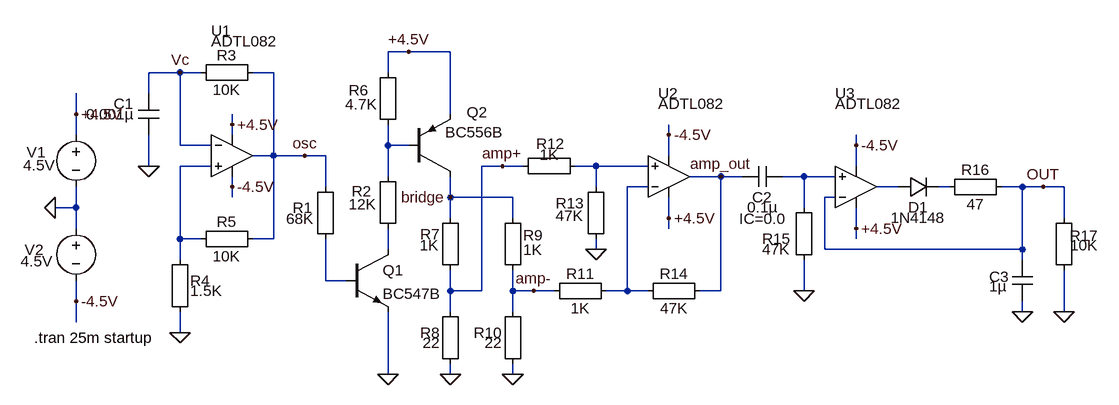
[diagram p0: schematic esr_meter.asc]
esr_meter.asc, the LTspice schematic file:
Version 4
SHEET 1 1856 680
WIRE 512 -16 480 -16
WIRE 576 -16 512 -16
WIRE 160 16 112 16
WIRE 192 16 160 16
WIRE 304 16 272 16
WIRE 480 16 480 -16
WIRE 112 48 112 16
WIRE 0 80 0 48
WIRE 576 80 576 -16
WIRE 240 96 240 80
WIRE 0 112 0 80
WIRE 240 112 240 96
WIRE 912 112 912 96
WIRE 160 128 160 16
WIRE 208 128 160 128
WIRE 480 128 480 96
WIRE 512 128 480 128
WIRE 1200 128 1200 112
WIRE 304 144 304 16
WIRE 304 144 272 144
WIRE 352 144 304 144
WIRE 384 144 352 144
WIRE 912 144 912 112
WIRE 112 160 112 112
WIRE 208 160 160 160
WIRE 656 160 624 160
WIRE 688 160 656 160
WIRE 800 160 768 160
WIRE 880 160 800 160
WIRE 1200 160 1200 128
WIRE 480 176 480 128
WIRE 992 176 944 176
WIRE 1024 176 992 176
WIRE 1120 176 1088 176
WIRE 1168 176 1120 176
WIRE 240 192 240 176
WIRE 384 192 384 144
WIRE 800 192 800 160
WIRE 880 192 848 192
WIRE 1264 192 1232 192
WIRE 1344 192 1328 192
WIRE 1456 192 1424 192
WIRE 1488 192 1456 192
WIRE 1520 192 1488 192
WIRE 240 208 240 192
WIRE 576 208 576 176
WIRE 672 208 576 208
WIRE 1168 208 1152 208
WIRE 0 224 0 192
WIRE 0 224 -32 224
WIRE 1120 224 1120 176
WIRE 576 240 576 208
WIRE 672 240 672 208
WIRE 912 240 912 208
WIRE 1520 240 1520 192
WIRE 0 256 0 224
WIRE 912 256 912 240
WIRE 1200 256 1200 224
WIRE 160 272 160 160
WIRE 192 272 160 272
WIRE 304 272 304 144
WIRE 304 272 272 272
WIRE 1200 272 1200 256
WIRE 480 288 480 256
WIRE 800 288 800 272
WIRE 1152 288 1152 208
WIRE 1456 288 1456 192
WIRE 1456 288 1152 288
WIRE 160 304 160 272
WIRE 1456 304 1456 288
WIRE 384 336 384 272
WIRE 416 336 384 336
WIRE 576 352 576 320
WIRE 624 352 624 160
WIRE 624 352 576 352
WIRE 672 352 672 320
WIRE 704 352 672 352
WIRE 736 352 704 352
WIRE 848 352 848 192
WIRE 848 352 816 352
WIRE 880 352 848 352
WIRE 992 352 992 176
WIRE 992 352 960 352
WIRE 1120 352 1120 304
WIRE 0 368 0 336
WIRE 576 384 576 352
WIRE 672 384 672 352
WIRE 1456 384 1456 368
WIRE 1520 384 1520 320
WIRE 0 400 0 368
WIRE 160 416 160 384
WIRE 480 480 480 384
WIRE 576 480 576 464
WIRE 672 480 672 464
FLAG 0 80 +4.5V
FLAG 0 368 -4.5V
FLAG 240 96 +4.5V
FLAG 240 192 -4.5V
FLAG 112 160 0
FLAG 352 144 osc
FLAG -32 224 0
FLAG 160 16 Vc
FLAG 480 480 0
FLAG 576 480 0
FLAG 672 480 0
FLAG 512 -16 +4.5V
FLAG 576 208 bridge
FLAG 912 240 +4.5V
FLAG 912 112 -4.5V
FLAG 800 288 0
FLAG 1120 352 0
FLAG 1200 256 +4.5V
FLAG 1200 128 -4.5V
FLAG 1456 384 0
FLAG 1520 384 0
FLAG 1488 192 OUT
FLAG 992 176 amp_out
FLAG 656 160 amp+
FLAG 704 352 amp-
FLAG 160 416 0
SYMBOL voltage 0 96 R0
WINDOW 0 -76 43 Left 2
WINDOW 3 -81 63 Left 2
WINDOW 123 0 0 Left 2
WINDOW 39 -81 91 Left 2
SYMATTR InstName V1
SYMATTR Value 4.5V
SYMBOL Misc\\EuropeanResistor 288 0 R90
WINDOW 0 5 56 VBottom 2
WINDOW 3 27 56 VTop 2
SYMATTR InstName R3
SYMATTR Value 10K
SYMATTR SpiceLine tol=1 pwr=0.1
SYMBOL Misc\\EuropeanResistor 176 400 R180
WINDOW 0 0 64 Right 2
WINDOW 3 0 48 Right 2
SYMATTR InstName R4
SYMATTR Value 1.5K
SYMATTR SpiceLine tol=1 pwr=0.1
SYMBOL Misc\\EuropeanResistor 288 256 R90
WINDOW 0 5 56 VBottom 2
WINDOW 3 27 56 VTop 2
SYMATTR InstName R5
SYMATTR Value 10K
SYMATTR SpiceLine tol=1 pwr=0.1
SYMBOL cap 96 48 R0
WINDOW 0 -7 16 Right 2
WINDOW 3 -6 32 Right 2
SYMATTR InstName C1
SYMATTR Value 0.001µ
SYMATTR SpiceLine V=16 Irms=55.6m Rser=5.11126 Lser=0 mfg="KEMET" pn="C0603C102K4RAC" type="X7R"
SYMBOL voltage 0 240 R0
WINDOW 0 -79 49 Left 2
WINDOW 3 -85 66 Left 2
WINDOW 123 0 0 Left 2
WINDOW 39 -85 94 Left 2
SYMATTR InstName V2
SYMATTR Value 4.5V
SYMBOL Misc\\EuropeanResistor 368 176 R0
WINDOW 0 -35 48 Left 2
WINDOW 3 -45 65 Left 2
SYMATTR InstName R1
SYMATTR Value 68K
SYMATTR SpiceLine tol=1 pwr=0.1
SYMBOL Misc\\EuropeanResistor 496 272 R180
WINDOW 0 41 73 Left 2
WINDOW 3 34 53 Left 2
SYMATTR InstName R2
SYMATTR Value 12K
SYMATTR SpiceLine tol=1 pwr=0.1
SYMBOL Misc\\EuropeanResistor 496 112 R180
WINDOW 0 46 69 Left 2
WINDOW 3 32 47 Left 2
SYMATTR InstName R6
SYMATTR Value 4.7K
SYMATTR SpiceLine tol=1 pwr=0.1
SYMBOL Misc\\EuropeanResistor 592 336 R180
WINDOW 0 32 71 Left 2
WINDOW 3 34 54 Left 2
SYMATTR InstName R7
SYMATTR Value 1K
SYMATTR SpiceLine tol=1 pwr=0.1
SYMBOL Misc\\EuropeanResistor 592 480 R180
WINDOW 0 32 64 Left 2
WINDOW 3 32 48 Left 2
SYMATTR InstName R8
SYMATTR Value 22
SYMATTR SpiceLine tol=1 pwr=0.1
SYMBOL Misc\\EuropeanResistor 688 336 R180
WINDOW 0 -31 70 Left 2
WINDOW 3 -29 47 Left 2
SYMATTR InstName R9
SYMATTR Value 1K
SYMATTR SpiceLine tol=1 pwr=0.1
SYMBOL Misc\\EuropeanResistor 688 480 R180
WINDOW 0 32 64 Left 2
WINDOW 3 32 48 Left 2
SYMATTR InstName R10
SYMATTR Value 22
SYMATTR SpiceLine tol=1 pwr=0.1
SYMBOL npn 416 288 R0
SYMATTR InstName Q1
SYMATTR Value BC547B
SYMBOL pnp 512 176 M180
WINDOW 0 89 99 Left 2
SYMATTR InstName Q2
SYMATTR Value BC556B
SYMBOL Misc\\EuropeanResistor 720 368 R270
WINDOW 0 27 56 VTop 2
WINDOW 3 5 56 VBottom 2
SYMATTR InstName R11
SYMATTR Value 1K
SYMATTR SpiceLine tol=1 pwr=0.1
SYMBOL Misc\\EuropeanResistor 672 176 R270
WINDOW 0 66 58 VBottom 2
WINDOW 3 49 56 VBottom 2
SYMATTR InstName R12
SYMATTR Value 1K
SYMATTR SpiceLine tol=1 pwr=0.1
SYMBOL Misc\\EuropeanResistor 784 176 R0
WINDOW 0 -46 41 Left 2
WINDOW 3 -46 60 Left 2
SYMATTR InstName R13
SYMATTR Value 47K
SYMATTR SpiceLine tol=1 pwr=0.1
SYMBOL Misc\\EuropeanResistor 976 336 R90
WINDOW 0 5 56 VBottom 2
WINDOW 3 27 56 VTop 2
SYMATTR InstName R14
SYMATTR Value 47K
SYMATTR SpiceLine tol=1 pwr=0.1
SYMBOL cap 1088 160 R90
WINDOW 0 32 32 VTop 2
WINDOW 3 48 32 VTop 2
WINDOW 40 65 32 VTop 2
SYMATTR InstName C2
SYMATTR Value 0.1µ
SYMATTR SpiceLine V=10 Irms=728m Rser=0.14361 Lser=0 mfg="KEMET" pn="C0603C104K8RAC" type="X7R"
SYMATTR SpiceLine2 IC=0.0
SYMBOL Misc\\EuropeanResistor 1104 208 R0
WINDOW 0 -48 64 Left 2
WINDOW 3 -48 80 Left 2
SYMATTR InstName R15
SYMATTR Value 47K
SYMATTR SpiceLine tol=1 pwr=0.1
SYMBOL Misc\\EuropeanResistor 1328 208 R270
WINDOW 0 27 56 VTop 2
WINDOW 3 5 56 VBottom 2
SYMATTR InstName R16
SYMATTR Value 47
SYMATTR SpiceLine tol=1 pwr=0.1
SYMBOL cap 1440 304 R0
WINDOW 0 -35 26 Left 2
WINDOW 3 -35 41 Left 2
SYMATTR InstName C3
SYMATTR Value 1µ
SYMATTR SpiceLine V=10 Irms=2.59 Rser=0.0171188 Lser=0 mfg="KEMET" pn="C0603C105K8RAC" type="X7R"
SYMBOL diode 1264 208 R270
WINDOW 0 0 32 VBottom 2
WINDOW 3 -16 32 VBottom 2
SYMATTR InstName D1
SYMATTR Value 1N4148
SYMBOL Misc\\EuropeanResistor 1536 336 R180
WINDOW 0 -37 69 Left 2
WINDOW 3 -36 54 Left 2
SYMATTR InstName R17
SYMATTR Value 10K
SYMATTR SpiceLine tol=1 pwr=0.1
SYMBOL Opamps\\ADTL082 240 80 R0
WINDOW 0 -32 -128 Left 2
WINDOW 3 -32 -112 Left 2
SYMATTR InstName U1
SYMBOL Opamps\\ADTL082 912 240 M180
WINDOW 0 -16 192 Left 2
WINDOW 3 -16 176 Left 2
SYMATTR InstName U2
SYMBOL Opamps\\ADTL082 1200 256 M180
WINDOW 0 -32 208 Left 2
WINDOW 3 -32 192 Left 2
SYMATTR InstName U3
TEXT -64 424 Left 2 !.tran 25m startup

The netlist it stands for:
* esr_meter.asc
V1 +4.5V 0 4.5V
R3 osc Vc 10K tol=1 pwr=0.1
R4 0 N002 1.5K tol=1 pwr=0.1
R5 osc N002 10K tol=1 pwr=0.1
C1 Vc 0 0.001µ V=16 Irms=55.6m Rser=5.11126 Lser=0 mfg="KEMET" pn="C0603C102K4RAC" type="X7R"
V2 0 -4.5V 4.5V
R1 osc N009 68K tol=1 pwr=0.1
R2 N008 N001 12K tol=1 pwr=0.1
R6 N001 +4.5V 4.7K tol=1 pwr=0.1
R7 amp+ bridge 1K tol=1 pwr=0.1
R8 0 amp+ 22 tol=1 pwr=0.1
R9 amp- bridge 1K tol=1 pwr=0.1
R10 0 amp- 22 tol=1 pwr=0.1
Q1 N008 N009 0 0 BC547B
Q2 bridge N001 +4.5V 0 BC556B
R11 amp- N005 1K tol=1 pwr=0.1
R12 amp+ N003 1K tol=1 pwr=0.1
R13 N003 0 47K tol=1 pwr=0.1
R14 amp_out N005 47K tol=1 pwr=0.1
C2 N004 amp_out 0.1µ V=10 Irms=728m Rser=0.14361 Lser=0 mfg="KEMET" pn="C0603C104K8RAC" type="X7R" IC=0.0
R15 N004 0 47K tol=1 pwr=0.1
R16 N007 OUT 47 tol=1 pwr=0.1
C3 OUT 0 1µ V=10 Irms=2.59 Rser=0.0171188 Lser=0 mfg="KEMET" pn="C0603C105K8RAC" type="X7R"
D1 N006 N007 1N4148
R17 0 OUT 10K tol=1 pwr=0.1
XU1 N002 Vc +4.5V -4.5V osc ADTL082  ; pins In+ In- V+ V- OUT
XU2 N003 N005 +4.5V -4.5V amp_out ADTL082  ; pins In+ In- V+ V- OUT
XU3 N004 OUT +4.5V -4.5V N006 ADTL082  ; pins In+ In- V+ V- OUT
.model D D
.lib standard.dio
.model NPN NPN
.model PNP PNP
.lib standard.bjt
.tran 25m startup
.lib ADI.lib
.backanno
.end